# EAGLE schematic tela_oled (EAGLE 9.6.2)
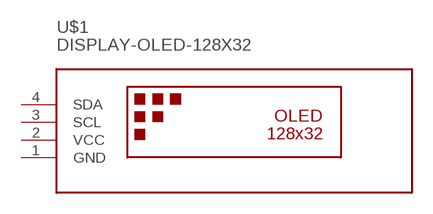
[diagram p0: schematic, sheet 1]

## Parts
U$1  DISPLAY-OLED-128X32  [DISPLAY-OLED-128X32]
Unconnected: U$1.3(SCL) U$1.4(SDA)

## Power pins joined to a net without a drawn wire
GND: U$1.1(GND)
VCC: U$1.2(VCC)

## Library data of the parts
U$1 = diy-modules:DISPLAY-OLED-128X32: 128x32 Dot Matrix OLED Module with I2C interface based on SSD1306 chip More details available here: http://www.tinyosshop.com/index.php?route=product/product&product_id=953 Schematic available here: http://www.tinyosshop.com/datasheet/OLED%2012832.pdf SSD1306 datasheet: https://cdn-shop.adafruit.com/datasheets/SSD1306.pdf Click here to find device on ebay.com <http://www.ebay.com/sch/oled+display+128x32+i2c>